# EAGLE schematic lfovca-rev1 (EAGLE 9.6.2)
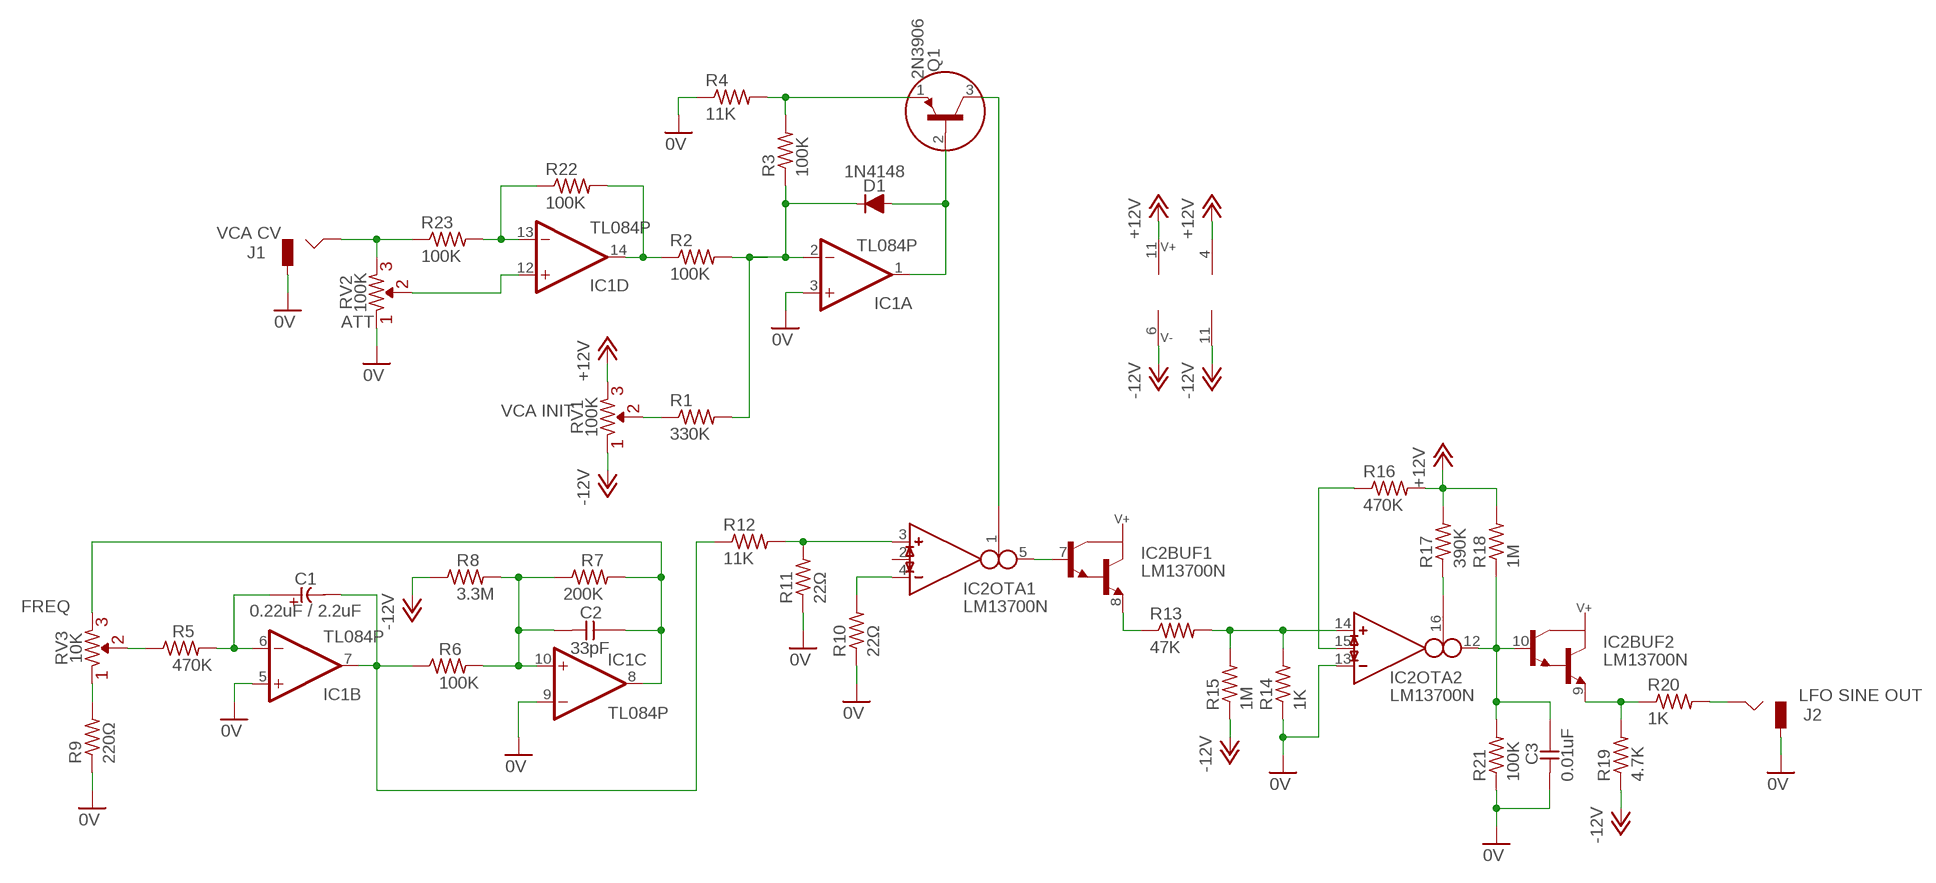
[diagram p0: schematic, sheet 1]

## Parts
C1  0.22uF / 2.2uF  CE-USE2-5  [E2-5]
C2  33pF  CC-US025-024X044  [C025-024X044]
C3  0.01uF  CC-US025-024X044  [C025-024X044]
D1  1N4148  [DO34-5]
IC1  TL084P  [DIL14]
IC2  LM13700N  [DIL16]
J1  JACK-M  [JACK-M]
J2  JACK-M  [JACK-M]
Q1  2N3906  [TO92]
R1  330K  R-US_0207/7  [0207/7]
R2  100K  R-US_0207/7  [0207/7]
R3  100K  R-US_0207/7  [0207/7]
R4  11K  R-US_0207/7  [0207/7]
R5  470K  R-US_0207/7  [0207/7]
R6  100K  R-US_0207/7  [0207/7]
R7  200K  R-US_0207/7  [0207/7]
R8  3.3M  R-US_0207/7  [0207/7]
R9  220Ω  R-US_0207/7  [0207/7]
R10  22Ω  R-US_0207/7  [0207/7]
R11  22Ω  R-US_0207/7  [0207/7]
R12  11K  R-US_0207/7  [0207/7]
R13  47K  R-US_0207/7  [0207/7]
R14  1K  R-US_0207/7  [0207/7]
R15  1M  R-US_0207/7  [0207/7]
R16  470K  R-US_0207/7  [0207/7]
R17  390K  R-US_0207/7  [0207/7]
R18  1M  R-US_0207/7  [0207/7]
R19  4.7K  R-US_0207/7  [0207/7]
R20  1K  R-US_0207/7  [0207/7]
R21  100K  R-US_0207/7  [0207/7]
R22  100K  R-US_0207/7  [0207/7]
R23  100K  R-US_0207/7  [0207/7]
RV1  100K  R-VAR  [R-VAR]
RV2  100K  R-VAR  [R-VAR]
RV3  10K  R-VAR  [R-VAR]

## Nets
0V: C3.2 IC1.3(A:+IN) IC1.5(B:+IN) IC1.9(C:-IN) IC2.4(OTA1:IN_N) IC2.13(OTA2:IN_N) J1.GND J2.GND R4.1 R9.1 R10.1 R10.2 R11.1 R14.1 R21.1 RV2.R1
+12V: IC1.4(P:V+) IC2.11(SUPPLY:V+) R16.2 R17.2 R18.2 RV1.R2
-12V: IC1.11(P:V-) R8.1 R15.1 R19.1 RV1.R1
IN1: IC2.3(OTA1:IN_P) R11.2 R12.2
N$1: R1.1 RV1.VAR
N$2: Q1.1(E) R3.2 R4.2
N$3: IC1.12(D:+IN) RV2.VAR
N$5: D1.A IC1.1(A:OUT) Q1.2(B)
N$6: D1.C IC1.2(A:-IN) R1.2 R2.2 R3.1
N$7: IC2.1(OTA1:I_BIAS) Q1.3(C)
N$8: C1.+ IC1.6(B:-IN) R5.2
N$9: C1.- IC1.7(B:OUT) R6.1 R12.1
N$10: IC2.8(BUF1:E) R13.1
N$11: IC2.14(OTA2:IN_P) R13.2 R14.2 R15.2
N$12: C2.2 IC1.10(C:+IN) R6.2 R7.1 R8.2
N$13: C2.1 IC1.8(C:OUT) R7.2 RV3.R2
N$14: IC2.15(OTA2:I_DIODE) R16.1
N$15: IC2.5(OTA1:OUT) IC2.7(BUF1:B)
N$16: R5.1 RV3.VAR
N$17: R9.2 RV3.R1
N$18: C3.1 IC2.10(BUF2:B) IC2.12(OTA2:OUT) R18.1 R21.2
N$19: IC2.16(OTA2:I_BIAS) R17.1
N$20: IC2.9(BUF2:E) R19.2 R20.1
N$21: J2.HOT R20.2
N$22: IC1.13(D:-IN) R22.1 R23.2
N$23: IC1.14(D:OUT) R2.1 R22.2
N$24: J1.HOT R23.1 RV2.R2
V-: IC2.6(SUPPLY:V-) ; supply symbol labelled -12V
Unconnected: IC2.2(OTA1:I_DIODE)

## Notes on the sheet
- VCA CV
- ATT
- VCA INIT
- FREQ
- LFO SINE OUT

## Library data of the parts
C1 = _common.v1:CE-US: ELECTROLYTIC CAPACITOR, US symbol
C2 C3 = _common.v1:CC-US: CAPACITOR, US symbol
D1 = _common:1N4148: DIODE high speed (Philips)
IC1 = linear:TL084: OP AMP
IC2 = ota:LM13700: Dual OTA with buffers
J1 J2 = _common.v1:JACK-M
Q1 = _common:2N3906: PNP Transistor
R1-R23 = resistor:R-US_: RESISTOR, American symbol
RV1-RV3 = _common:R-VAR